# Altium schematic sheet Nano103.SchDoc
size A3
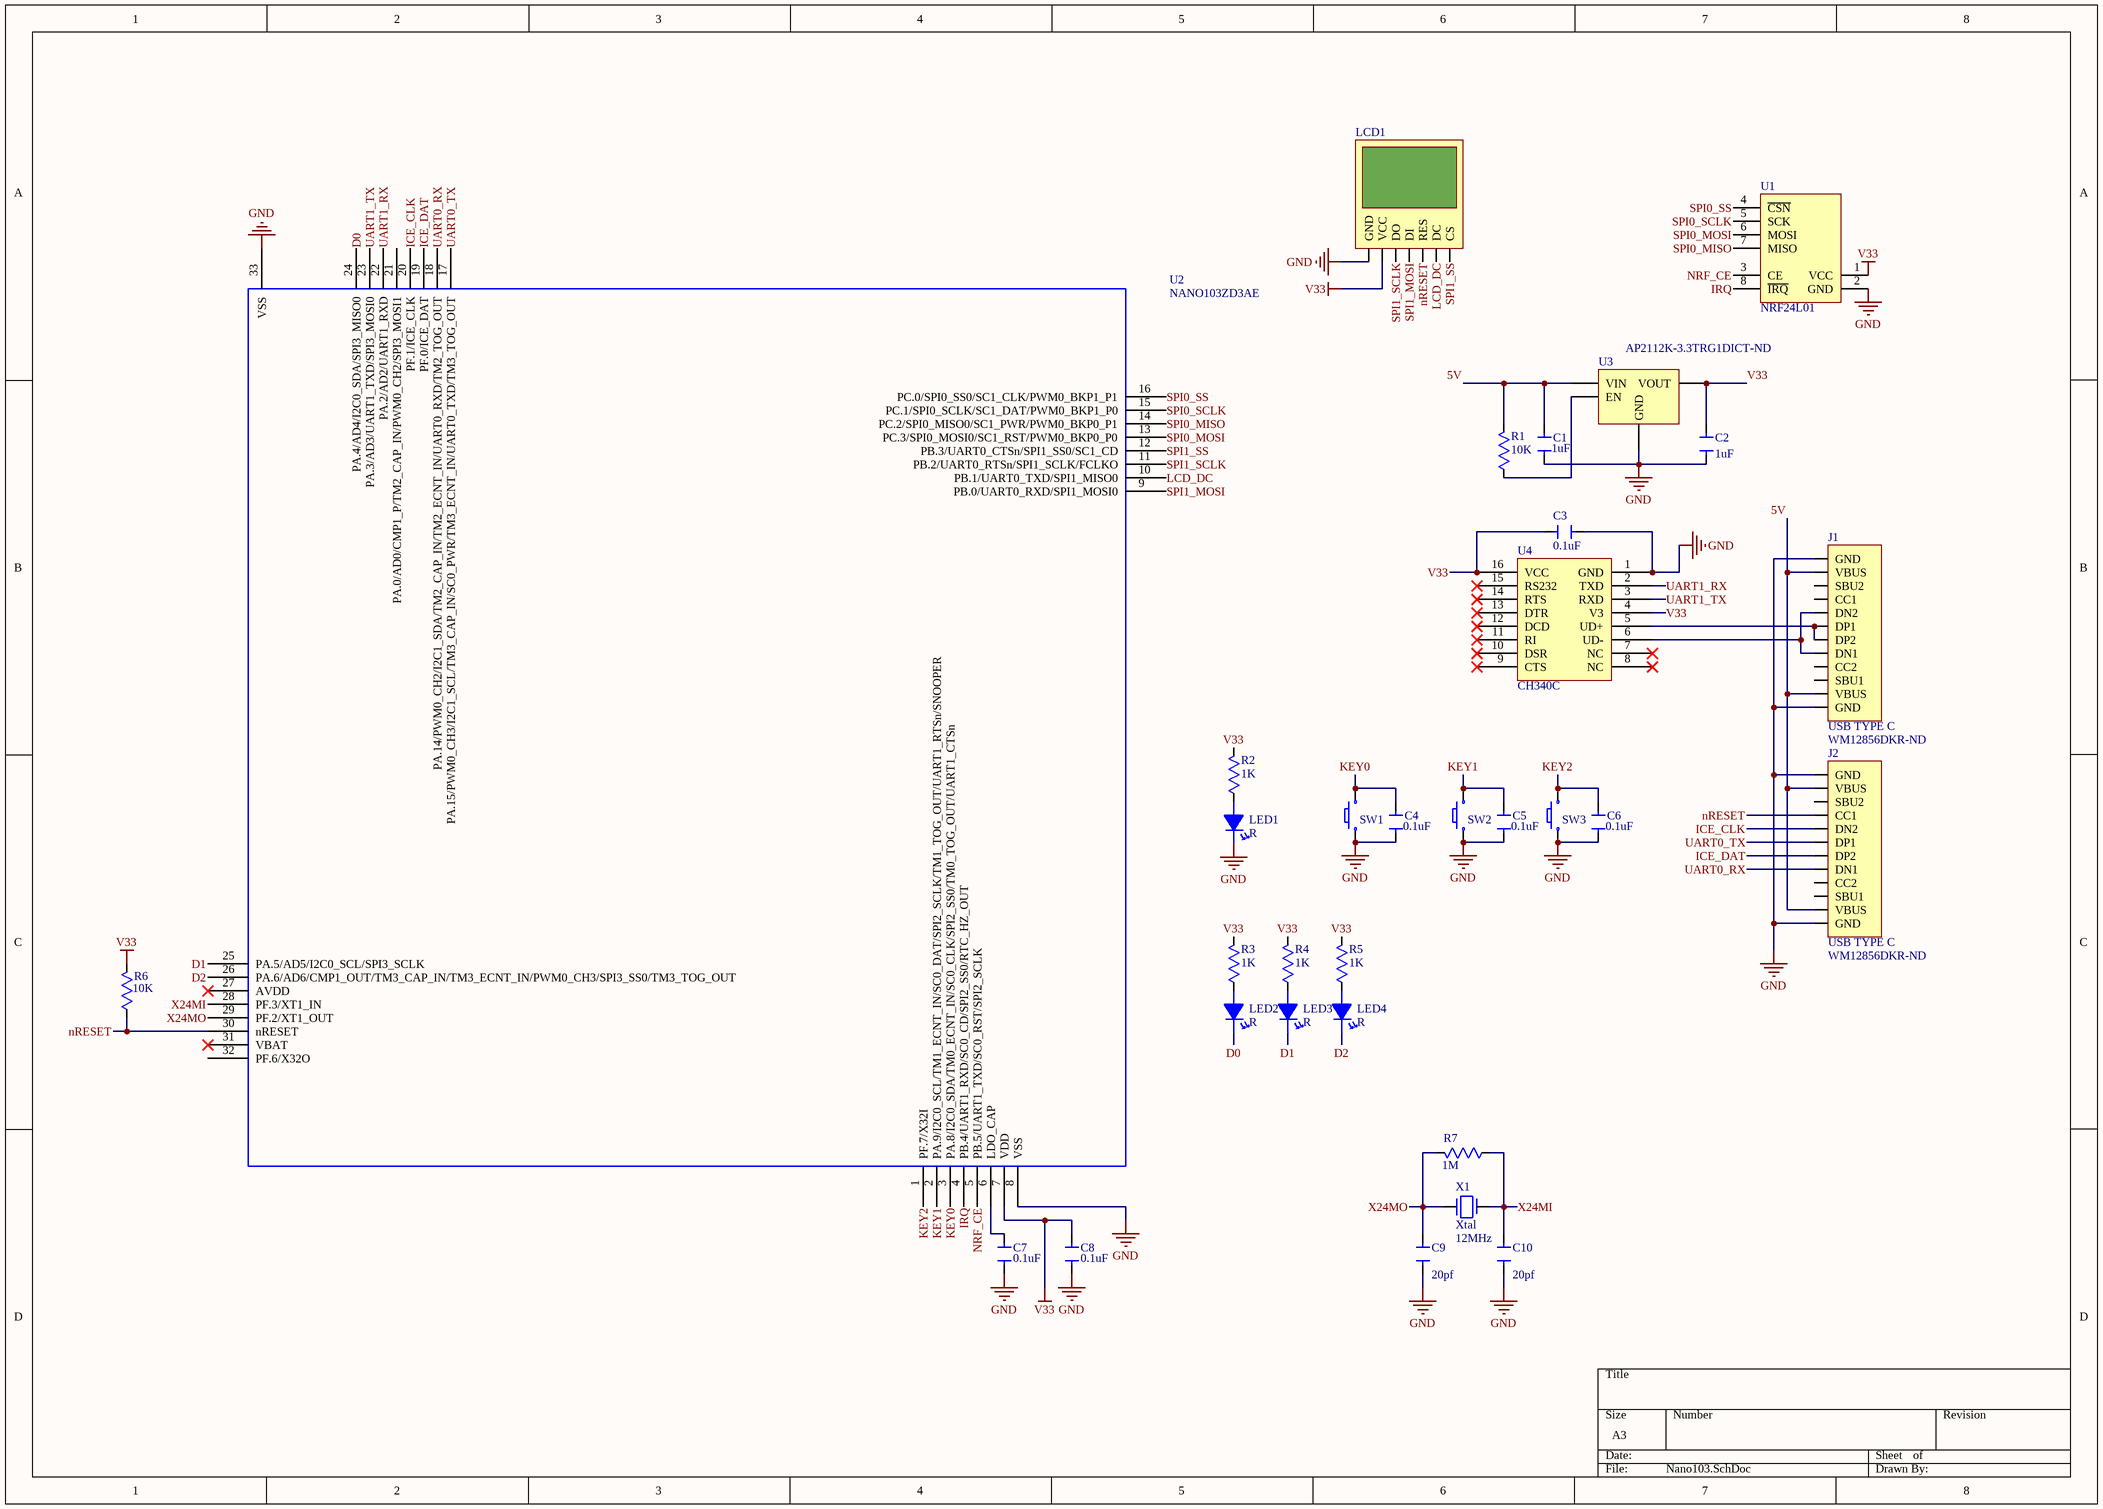
[diagram p0: Nano103.SchDoc]

## Parts
C1  value 1uF  [CAP_0402]  (hidden comment: Cap)
C2  value 1uF  [CAP_0402]  (hidden comment: Cap)
C3  value 0.1uF  [CAP_0402]  (hidden comment: Cap)
C4  value 0.1uF  [CAP_0402]  (hidden comment: Cap)
C5  value 0.1uF  [CAP_0402]  (hidden comment: Cap)
C6  value 0.1uF  [CAP_0402]  (hidden comment: Cap)
C7  value 0.1uF  [CAP_0402]  (hidden comment: Cap)
C8  value 0.1uF  [CAP_0402]  (hidden comment: Cap)
C9  value 20pf  [CAP_0402]  (hidden comment: Cap)
C10  value 20pf  [CAP_0402]  (hidden comment: Cap)
J1  USB TYPE C  Supplier Part Number 1: WM12856DKR-ND  [USBC-SMD16F]
J2  USB TYPE C  Supplier Part Number 1: WM12856DKR-ND  [USBC-SMD16F]
LCD1  LCD096  [LCD096]  (value not drawn)
LED1  R  [SMD-0603_LED]
LED2  R  [SMD-0603_LED]
LED3  R  [SMD-0603_LED]
LED4  R  [SMD-0603_LED]
R1  value 10K  [RES_0402]  (hidden comment: Res)
R2  value 1K  [RES_0402]  (hidden comment: Res)
R3  value 1K  [RES_0402]  (hidden comment: Res)
R4  value 1K  [RES_0402]  (hidden comment: Res)
R5  value 1K  [RES_0402]  (hidden comment: Res)
R6  value 10K  [RES_0402]  (hidden comment: Res)
R7  value 1M  [RES_0402]  (hidden comment: Res)
SW1  SPST  [ST01-111]  (value not drawn)
SW2  SPST  [ST01-111]  (value not drawn)
SW3  SPST  [ST01-111]  (value not drawn)
U1  NRF24L01  [NRF24L01P+PA+LNA+IPX]
U2  NANO103ZD3AE  [MCU_QFN_33_5x5]
U3  Supplier Part Number 1: AP2112K-3.3TRG1DICT-ND  [SOT23-5]  (hidden comment: AP2112K-3.3TRG1)
U4  CH340C  [SOP-16]
X1  Xtal  value 12MHz  [2520S]

## Nets
GND: C1.2 C2.2 C3.2 C4.2 C5.2 C6.2 C7.2 C8.2 C9.2 C10.2 J1.1(GND) J1.12(GND) J2.1(GND) J2.12(GND) LCD1.1(GND) LED1.2 SW1.2 SW2.2 SW3.2 U1.2(GND) U2.8(VSS) U2.33(VSS) U3.3(GND) U4.1(GND)
V33: C2.1 C3.1 C8.1 LCD1.2(VCC) R2.1 R3.1 R4.1 R5.1 R6.1 U1.1(VCC) U2.7(VDD) U3.4(VOUT) U4.4(V3) U4.16(VCC)
5V: C1.1 J1.2(VBUS) J1.11(VBUS) J2.2(VBUS) J2.11(VBUS) R1.1 U3.1(VIN)
D0: LED2.2 U2.24(PA.4/AD4/I2C0_SDA/SPI3_MISO0)
D1: LED3.2 U2.25(PA.5/AD5/I2C0_SCL/SPI3_SCLK)
D2: LED4.2 U2.26(PA.6/AD6/CMP1_OUT/TM3_CAP_IN/TM3_ECNT_IN/PWM0_CH3/SPI3_SS0/TM3_TOG_OUT)
ICE_CLK: J2.5(DN2) U2.20(PF.1/ICE_CLK)
ICE_DAT: J2.7(DP2) U2.19(PF.0/ICE_DAT)
IRQ: U1.8(~{IRQ}) U2.4(PB.4/UART1_RXD/SC0_CD/SPI2_SS0/RTC_HZ_OUT)
KEY0: C4.1 SW1.1 U2.3(PA.8/I2C0_SDA/TM0_ECNT_IN/SC0_CLK/SPI2_SS0/TM0_TOG_OUT/UART1_CTSn)
KEY1: C5.1 SW2.1 U2.2(PA.9/I2C0_SCL/TM1_ECNT_IN/SC0_DAT/SPI2_SCLK/TM1_TOG_OUT/UART1_RTSn/SNOOPER)
KEY2: C6.1 SW3.1 U2.1(PF.7/X32I)
LCD_DC: LCD1.6(DC) U2.10(PB.1/UART0_TXD/SPI1_MISO0)
nRESET: J2.4(CC1) LCD1.5(RES) R6.2 U2.30(nRESET)
NRF_CE: U1.3(CE) U2.5(PB.5/UART1_TXD/SC0_RST/SPI2_SCLK)
SPI0_MISO: U1.7(MISO) U2.14(PC.2/SPI0_MISO0/SC1_PWR/PWM0_BKP0_P1)
SPI0_MOSI: U1.6(MOSI) U2.13(PC.3/SPI0_MOSI0/SC1_RST/PWM0_BKP0_P0)
SPI0_SCLK: U1.5(SCK) U2.15(PC.1/SPI0_SCLK/SC1_DAT/PWM0_BKP1_P0)
SPI0_SS: U1.4(~{CSN}) U2.16(PC.0/SPI0_SS0/SC1_CLK/PWM0_BKP1_P1)
SPI1_MOSI: LCD1.4(DI) U2.9(PB.0/UART0_RXD/SPI1_MOSI0)
SPI1_SCLK: LCD1.3(DO) U2.11(PB.2/UART0_RTSn/SPI1_SCLK/FCLKO)
SPI1_SS: LCD1.7(CS) U2.12(PB.3/UART0_CTSn/SPI1_SS0/SC1_CD)
UART0_RX: J2.8(DN1) U2.18(PA.14/PWM0_CH2/I2C1_SDA/TM2_CAP_IN/TM2_ECNT_IN/UART0_RXD/TM2_TOG_OUT)
UART0_TX: J2.6(DP1) U2.17(PA.15/PWM0_CH3/I2C1_SCL/TM3_CAP_IN/SC0_PWR/TM3_ECNT_IN/UART0_TXD/TM3_TOG_OUT)
UART1_RX: U2.22(PA.2/AD2/UART1_RXD) U4.2(TXD)
UART1_TX: U2.23(PA.3/AD3/UART1_TXD/SPI3_MOSI0) U4.3(RXD)
X24MI: C10.1 R7.2 U2.28(PF.3/XT1_IN) X1.1
X24MO: C9.1 R7.1 U2.29(PF.2/XT1_OUT) X1.2
NetC7_1: C7.1 U2.6(LDO_CAP)
NetJ1_5: J1.5(DN2) J1.8(DN1) U4.6(UD-)
NetJ1_6: J1.6(DP1) J1.7(DP2) U4.5(UD+)
NetLED1_1: LED1.1 R2.2
NetLED2_1: LED2.1 R3.2
NetLED3_1: LED3.1 R4.2
NetLED4_1: LED4.1 R5.2
NetR1_2: R1.2 U3.2(EN)

Not connected (* = marked no-connect by the designer): J1 3(SBU2) 4(CC1) 9(CC2) 10(SBU1); J2 3(SBU2) 9(CC2) 10(SBU1); U2 21(PA.0/AD0/CMP1_P/TM2_CAP_IN/PWM0_CH2/SPI3_MOSI1) 27(AVDD)* 31(VBAT)* 32(PF.6/X32O); U4 7(NC)* 8(NC)* 9(CTS)* 10(DSR)* 11(RI)* 12(DCD)* 13(DTR)* 14(RTS)* 15(RS232)*

## Library data of the parts
J1 J2 = USB TYPE C: USB Shielded I/O Receptacle; Type C; Right Angle; Surface Mount; Gold over Nickel; Manufacturer: Molex; Manufacturer Part Number: 105450-0101; Number of Contacts: 24; Current Rating: 5A; Mating Cycles: 10000; USB Standard: USB 3.1; Number of Ports: 1; Pitch: 0.5mm; Supplier 1: Digi-Key; RoHS: Yes; Category: Connectors; Stock 1: 21711; Pricing 1: 1=2.15000, 10=1.94900, 25=1.82960, 50=1.75000, 100=1.67050, 250=1.51140, 500=1.39208 (USD); Mount: Surface Mount,Through Hole,Horizontal; Case/Package: 0101; Number of Pins: 24; Contact Plating: Gold; Contact Material: Copper Alloy; Housing Material: Thermoplastic; Insulation Color: Black; Number of Terminals: 24; Min Operating Temperature: -30°C; Max Operating Temperature: 85°C; Packaging: Tape and Reel; Gender: Receptacle; Connector Type: USB; Orientation: Right Angle; Termination: Solder; Shielding: Shielded; Features: Shielded; Length: 8.94mm; REACH SVHC: Unknown; Flammability Rating: UL94 V-0; ComponentLink1URL: http://www.farnell.com/datasheets/2801634.pdf?src-supplier=Farnell; ComponentLink1Description: http://www.farnell.com/datasheets/2801634.pdf?src-supplier=Farnell; ComponentLink2URL: http://www.farnell.com/datasheets/2672741.pdf?src-supplier=Newark; ComponentLink2Description: http://www.farnell.com/datasheets/2672741.pdf?src-supplier=Newark; ComponentLink3URL: http://www.farnell.com/datasheets/2015275.pdf?src-supplier=Element14; ComponentLink3Description: http://www.farnell.com/datasheets/2015275.pdf?src-supplier=Element14; ComponentLink4URL: https://www.molex.com/pdm_docs/ps/PS-105448-001.pdf?src-supplier=Digi-Key; ComponentLink4Description: https://www.molex.com/pdm_docs/ps/PS-105448-001.pdf?src-supplier=Digi-Key; ComponentLink5URL: http://www.farnell.com/datasheets/2801634.pdf?src-supplier=Newark; ComponentLink5Description: http://www.farnell.com/datasheets/2801634.pdf?src-supplier=Newark; ComponentLink6URL: https://www.molex.com/pdm_docs/sd/1054500101_sd.pdf?src-supplier=Digi-Key; ComponentLink6Description: https://www.molex.com/pdm_docs/sd/1054500101_sd.pdf?src-supplier=Digi-Key; ComponentLink7URL: http://www.farnell.com/datasheets/2801634.pdf?src-supplier=Element14; ComponentLink7Description: http://www.farnell.com/datasheets/2801634.pdf?src-supplier=Element14; ComponentLink8URL: http://www.literature.molex.com/SQLImages/kelmscott/Molex/PDF_Images/987651-4081.PDF?src-supplier=Avnet; ComponentLink8Description: http://www.literature.molex.com/SQLImages/kelmscott/Molex/PDF_Images/987651-4081.PDF?src-supplier=Avnet; ComponentLink9URL: http://www.literature.molex.com/SQLImages/kelmscott/Molex/PDF_Images/987651-4081.PDF?src-supplier=Avnet+Asia; ComponentLink9Description: http://www.literature.molex.com/SQLImages/kelmscott/Molex/PDF_Images/987651-4081.PDF?src-supplier=Avnet+Asia
LED1-LED4 = LED
SW1-SW3 = Switch_Button1
U1 = NRF24L01_module: pin to pad: 2>8 3>2 4>3 5>4 6>5 7>6 8>7
U2 = NANO103ZD3AE: OriginalSymbolOrigin: (0,0)
U3 = AP2112K-3.3TRG1: IC REG LINEAR 3.3V 600MA SOT23-5; pin to pad: 2>3 3>2 4>5; Manufacturer: Diodes; Number of Regulators: 1; Quiescent Current: 55uA; Polarity: Positive; Max Input Voltage: 6V; Min Input Voltage: 2.5V; Accuracy: 1.5%; Dropout Voltage: 250mV; Output Type: Fixed; Supplier 1: Digi-Key; Manufacturer Part Number: AP2112K-3.3TRG1; RoHS: Yes; Category: Voltage Regulators - Linear; Stock 1: 54786; Pricing 1: 1=0.47000, 10=0.35500, 25=0.32000, 100=0.17450, 250=0.16872, 500=0.15126, 1000=0.11636 (USD); Mount: Surface Mount; Case/Package: SOT-23-5; Number of Pins: 5; Min Operating Temperature: -40°C; Max Operating Temperature: 85°C; Output Current: 600mA; Max Output Current: 600mA; Output Voltage: 3.3V; Number of Outputs: 1; Package Quantity: 1; Packaging: Tape and Reel; Length: 3.1mm; Height: 1.3mm; Width: 1.7mm; Lead Free: Lead Free; ComponentLink1URL: https://datasheet.ciiva.com/29569/ap2112-29569919.pdf?src-supplier=Digi-Key; ComponentLink1Description: https://datasheet.ciiva.com/29569/ap2112-29569919.pdf?src-supplier=Digi-Key; ComponentLink2URL: https://datasheet.ciiva.com/30016/ap2112-30016792.pdf?src-supplier=Avnet; ComponentLink2Description: https://datasheet.ciiva.com/30016/ap2112-30016792.pdf?src-supplier=Avnet; ComponentLink3URL: https://datasheet.ciiva.com/29569/ap2112-29569917.pdf?src-supplier=Digi-Key; ComponentLink3Description: https://datasheet.ciiva.com/29569/ap2112-29569917.pdf?src-supplier=Digi-Key; ComponentLink4URL: https://datasheet.ciiva.com/29569/ap2112-29569918.pdf?src-supplier=Digi-Key; ComponentLink4Description: https://datasheet.ciiva.com/29569/ap2112-29569918.pdf?src-supplier=Digi-Key